# Altium schematic sheet MPBoard_L4_Sens1_ext.SchDoc
size A3; SheetNumber: 4; SheetTotal: 5
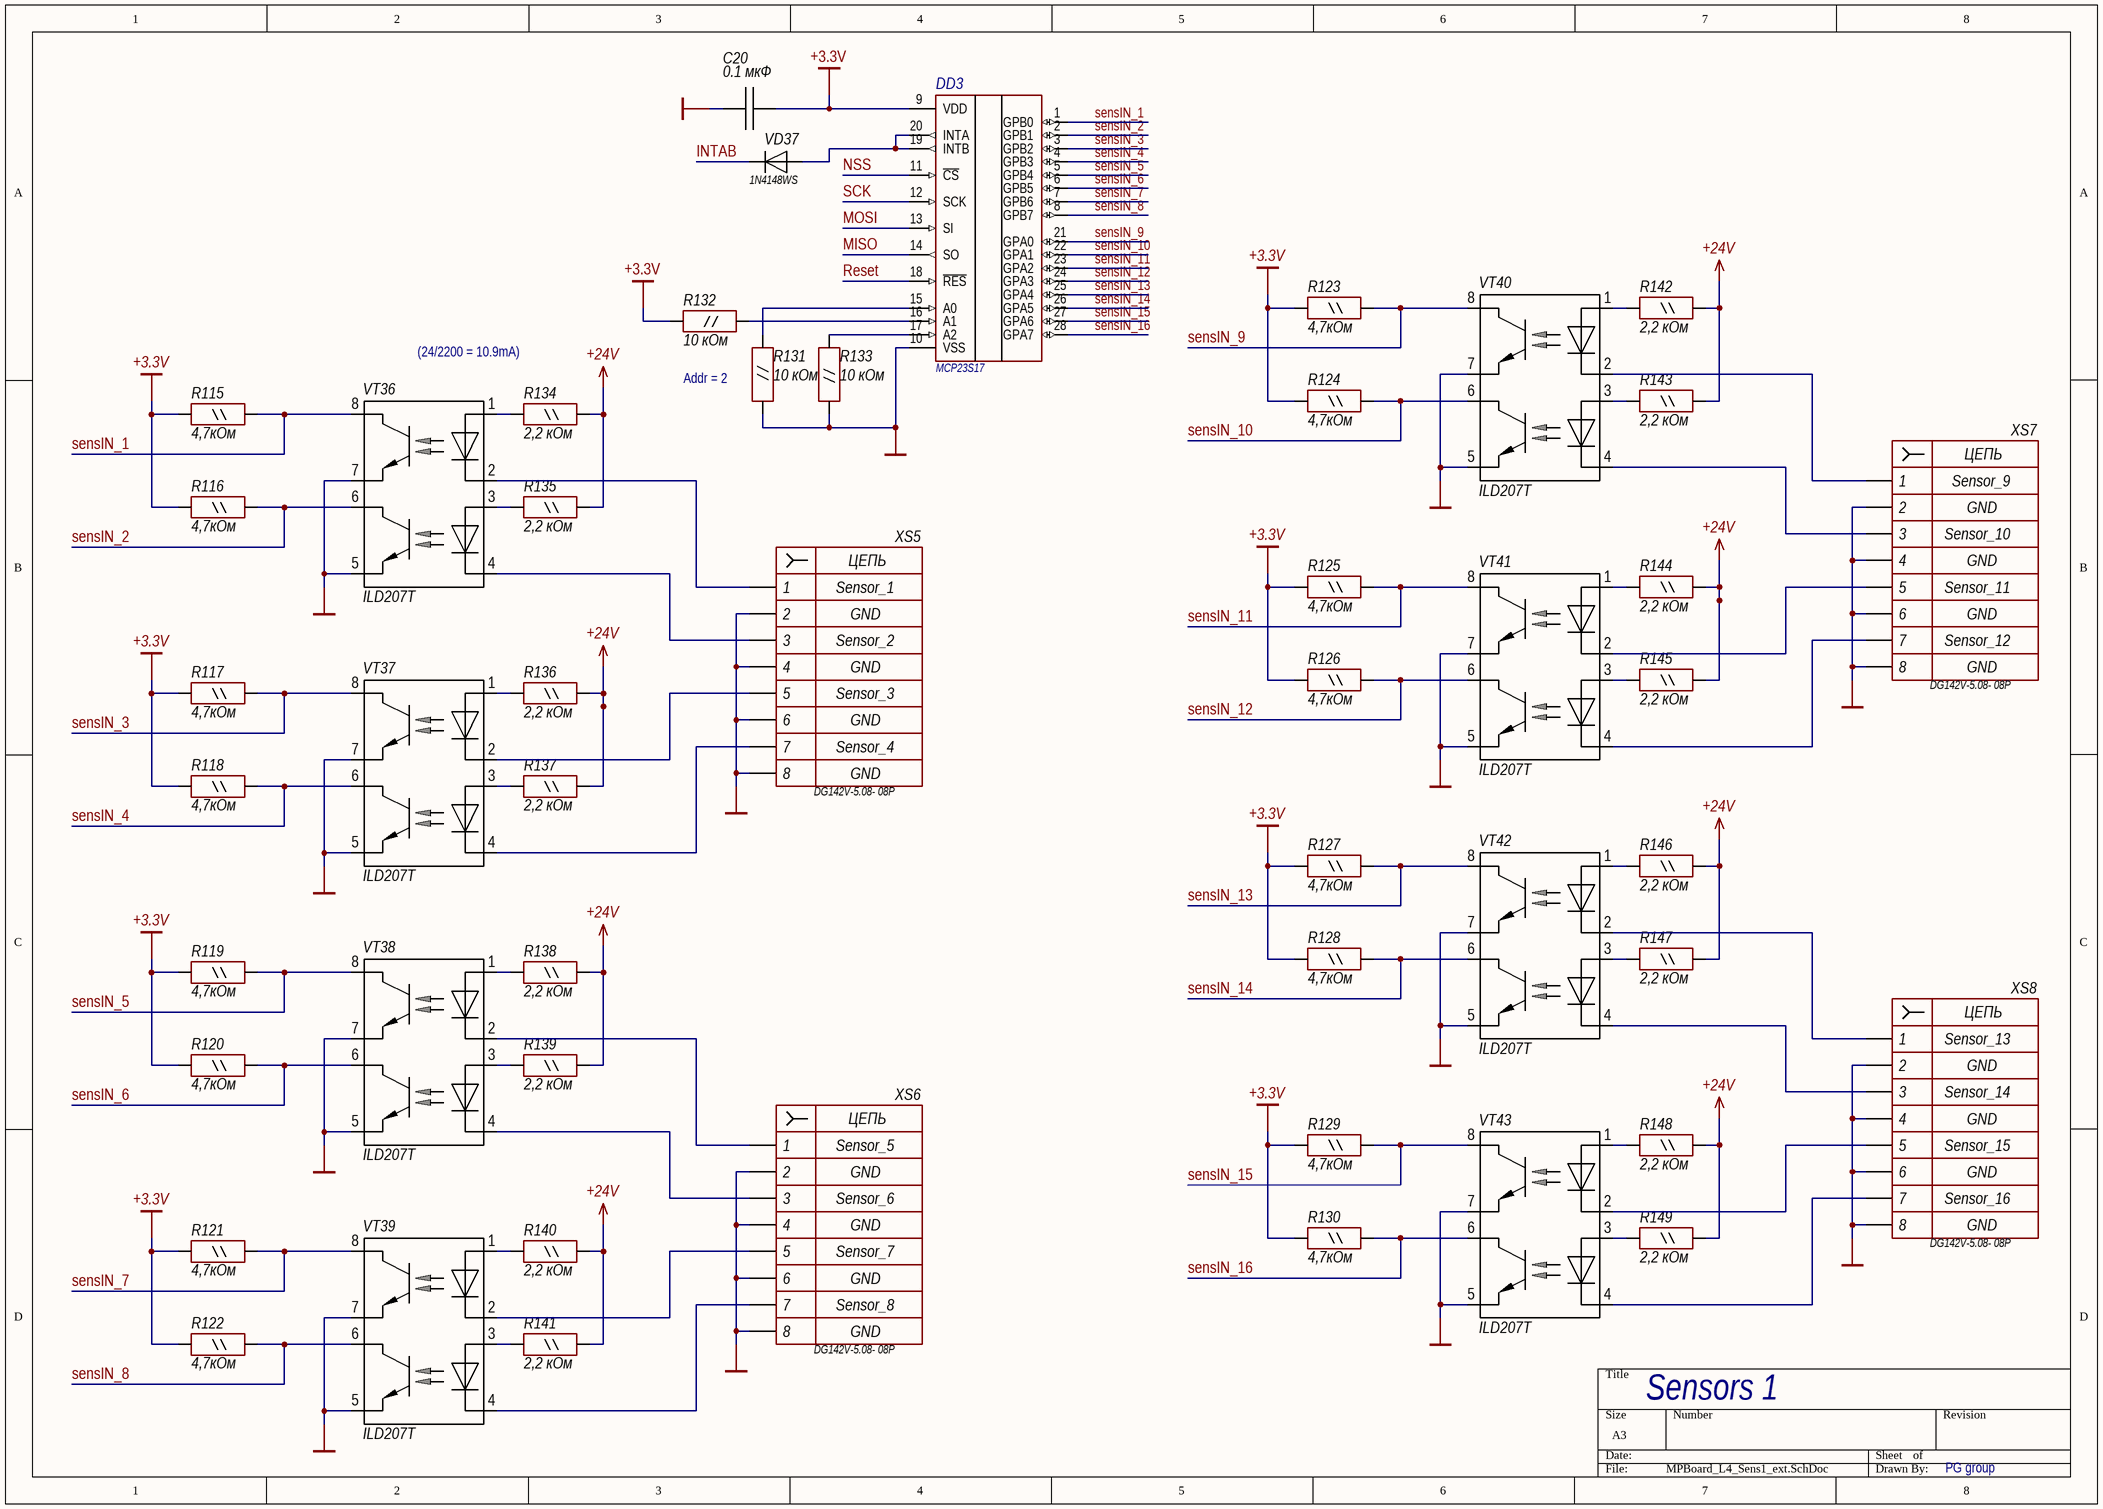
[diagram p0: MPBoard_L4_Sens1_ext.SchDoc]

## Parts
C20  0.1 мкФ  [CAP-0603]
DD3  MCP23S17  [SOIC-28]
R115  4,7кОм  [RES-0603]
R116  4,7кОм  [RES-0603]
R117  4,7кОм  [RES-0603]
R118  4,7кОм  [RES-0603]
R119  4,7кОм  [RES-0603]
R120  4,7кОм  [RES-0603]
R121  4,7кОм  [RES-0603]
R122  4,7кОм  [RES-0603]
R123  4,7кОм  [RES-0603]
R124  4,7кОм  [RES-0603]
R125  4,7кОм  [RES-0603]
R126  4,7кОм  [RES-0603]
R127  4,7кОм  [RES-0603]
R128  4,7кОм  [RES-0603]
R129  4,7кОм  [RES-0603]
R130  4,7кОм  [RES-0603]
R131  10 кОм  [RES-0603]
R132  10 кОм  [RES-0603]
R133  10 кОм  [RES-0603]
R134  2,2 кОм  [RES-0805]
R135  2,2 кОм  [RES-0805]
R136  2,2 кОм  [RES-0805]
R137  2,2 кОм  [RES-0805]
R138  2,2 кОм  [RES-0805]
R139  2,2 кОм  [RES-0805]
R140  2,2 кОм  [RES-0805]
R141  2,2 кОм  [RES-0805]
R142  2,2 кОм  [RES-0805]
R143  2,2 кОм  [RES-0805]
R144  2,2 кОм  [RES-0805]
R145  2,2 кОм  [RES-0805]
R146  2,2 кОм  [RES-0805]
R147  2,2 кОм  [RES-0805]
R148  2,2 кОм  [RES-0805]
R149  2,2 кОм  [RES-0805]
VD37  1N4148WS  [SOD-323]
VT36  ILD207T  [SOIC-8]
VT37  ILD207T  [SOIC-8]
VT38  ILD207T  [SOIC-8]
VT39  ILD207T  [SOIC-8]
VT40  ILD207T  [SOIC-8]
VT41  ILD207T  [SOIC-8]
VT42  ILD207T  [SOIC-8]
VT43  ILD207T  [SOIC-8]
XS5  DG142V-5.08- 08P  NET6: GND  NET5: Sensor_3  NET1: Sensor_1  NET3: Sensor_2  NET7: Sensor_4  [DG142V-5.08-08]
XS6  DG142V-5.08- 08P  NET6: GND  NET5: Sensor_7  NET1: Sensor_5  NET3: Sensor_6  NET7: Sensor_8  [DG142V-5.08-08]
XS7  DG142V-5.08- 08P  NET6: GND  NET5: Sensor_11  NET1: Sensor_9  NET3: Sensor_10  NET7: Sensor_12  [DG142V-5.08-08]
XS8  DG142V-5.08- 08P  NET6: GND  NET5: Sensor_15  NET1: Sensor_13  NET3: Sensor_14  NET7: Sensor_16  [DG142V-5.08-08]

## Nets
+3.3V: C20.2 DD3.9(VDD) R115.2 R116.2 R117.2 R118.2 R119.2 R120.2 R121.2 R122.2 R123.2 R124.2 R125.2 R126.2 R127.2 R128.2 R129.2 R130.2 R132.2
+24V: R134.1 R135.1 R136.1 R137.1 R138.1 R139.1 R140.1 R141.1 R142.1 R143.1 R144.1 R145.1 R146.1 R147.1 R148.1 R149.1
GND: C20.1 DD3.10(VSS) R131.2 R133.1 VT36.5 VT36.7 VT37.5 VT37.7 VT38.5 VT38.7 VT39.5 VT39.7 VT40.5 VT40.7 VT41.5 VT41.7 VT42.5 VT42.7 VT43.5 VT43.7 XS5.2 XS5.4 XS5.6 XS5.8 XS6.2 XS6.4 XS6.6 XS6.8 XS7.2 XS7.4 XS7.6 XS7.8 XS8.2 XS8.4 XS8.6 XS8.8
INTAB: VD37.2
MISO: DD3.14(SO)
MOSI: DD3.13(SI)
NSS: DD3.11(~{CS})
Reset: DD3.18(~{RES})
SCK: DD3.12(SCK)
sensIN_1: DD3.1(GPB0) R115.1 VT36.8
sensIN_2: DD3.2(GPB1) R116.1 VT36.6
sensIN_3: DD3.3(GPB2) R117.1 VT37.8
sensIN_4: DD3.4(GPB3) R118.1 VT37.6
sensIN_5: DD3.5(GPB4) R119.1 VT38.8
sensIN_6: DD3.6(GPB5) R120.1 VT38.6
sensIN_7: DD3.7(GPB6) R121.1 VT39.8
sensIN_8: DD3.8(GPB7) R122.1 VT39.6
sensIN_9: DD3.21(GPA0) R123.1 VT40.8
sensIN_10: DD3.22(GPA1) R124.1 VT40.6
sensIN_11: DD3.23(GPA2) R125.1 VT41.8
sensIN_12: DD3.24(GPA3) R126.1 VT41.6
sensIN_13: DD3.25(GPA4) R127.1 VT42.8
sensIN_14: DD3.26(GPA5) R128.1 VT42.6
sensIN_15: DD3.27(GPA6) R129.1 VT43.8
sensIN_16: DD3.28(GPA7) R130.1 VT43.6
NetDD3_15: DD3.15(A0) R131.1
NetDD3_16: DD3.16(A1) R132.1
NetDD3_17: DD3.17(A2) R133.2
NetDD3_19: DD3.19(INTB) DD3.20(INTA) VD37.1
NetR134_2: R134.2 VT36.1
NetR135_2: R135.2 VT36.3
NetR136_2: R136.2 VT37.1
NetR137_2: R137.2 VT37.3
NetR138_2: R138.2 VT38.1
NetR139_2: R139.2 VT38.3
NetR140_2: R140.2 VT39.1
NetR141_2: R141.2 VT39.3
NetR142_2: R142.2 VT40.1
NetR143_2: R143.2 VT40.3
NetR144_2: R144.2 VT41.1
NetR145_2: R145.2 VT41.3
NetR146_2: R146.2 VT42.1
NetR147_2: R147.2 VT42.3
NetR148_2: R148.2 VT43.1
NetR149_2: R149.2 VT43.3
NetVT36_2: VT36.2 XS5.1
NetVT36_4: VT36.4 XS5.3
NetVT37_2: VT37.2 XS5.5
NetVT37_4: VT37.4 XS5.7
NetVT38_2: VT38.2 XS6.1
NetVT38_4: VT38.4 XS6.3
NetVT39_2: VT39.2 XS6.5
NetVT39_4: VT39.4 XS6.7
NetVT40_2: VT40.2 XS7.1
NetVT40_4: VT40.4 XS7.3
NetVT41_2: VT41.2 XS7.5
NetVT41_4: VT41.4 XS7.7
NetVT42_2: VT42.2 XS8.1
NetVT42_4: VT42.4 XS8.3
NetVT43_2: VT43.2 XS8.5
NetVT43_4: VT43.4 XS8.7

## Notes on the sheet
- (24/2200 = 10.9mA)
- (near R131) Addr = 2
- Sensors 1
- PG group
- (in symbol XS8) ЦЕПЬ

## Library data of the parts
C20 = C: Конденсатор; MFPartNum: C0603C101K5GAC; IPSPartNumber: 65-724-19; Dielectric: X7R; MF: KEMET; Tolerance: ± 10 %; Voltage: 50 В; ValueDescription: Конденсатор 0.1 мкФ ± 10 % 50 В X7R SMD 0603; Package: SMD 0603; Value: 0.1 мкФ; HelpURL: https://content.kemet.com/datasheets/KEM_C1002_X7R_SMD.pdf; NameRUS: Конденсатор
DD3 = DD_MCP23S17: I/O Expander 16 SPI; MF: Microchip; MFPartNum: MCP23S17; Package: SOIC-28; HelpURL: https://www.chipdip.ru/product/mcp23s17-e-so
R115-R130 = R_0.125W: Резистор 0.1 W; MFPartNum: D11/CRCW0603; MF: Vishay; Tolerance: ± 1 %; ValueDescription: Резистор 4,7кОм ± 1 % SMD 0603; Package: SMD 0603; Value: 4,7кОм; HelpURL: https://www.vishay.com/docs/20035/dcrcwe3.pdf; IPSPartNumber: *; NameRUS: Резистор
R131-R133 = R_0.125W: Резистор 0.1 W; MFPartNum: D11/CRCW0603; MF: Vishay; Tolerance: ± 1 %; ValueDescription: Резистор 10 кОм ± 1 % SMD 0603; Package: SMD 0603; Value: 10 кОм; HelpURL: https://www.vishay.com/docs/20035/dcrcwe3.pdf; IPSPartNumber: *; NameRUS: Резистор
R134-R149 = R_0.125W: Резистор 0.125 W; MFPartNum: CRCW080513K3FKEA; MF: Vishay; Tolerance: ± 1 %; ValueDescription: Резистор 2,2 кОм ± 1 % SMD 0805; Package: SMD 0805; Value: 2,2 кОм; HelpURL: https://www.vishay.com/docs/20035/dcrcwe3.pdf; IPSPartNumber: *; NameRUS: Резистор
VD37 = VD: Диод Выпрямительный; MF: Diotec Semiconductor; ValueDescription: Диод выпрямительный 1N4148WS SOD-323F; MFPartNum: 1N4148WS; HelpURL: https://www.chipdip.by/product/1n4148ws-4; Value: 1N4148WS; Package: SOD-323F; NameRUS: Диод выпрямительный
VT36-VT43 = VT_2xOPTOCOUPLER: Оптопара; MF: Vishay; MFPartNum: ILD207T; Package: SOIC-8; HelpURL: https://www.chipdip.by/product/ild207-t
XS5-XS8 = XS8: розетка 8 контактов; MFPartNum: DG142V-5.08- 08P-14-00A(H); MF: Degson Electronics; ValueDescription: Разъем розетка DG142V-5.08- 08P; NameRUS: Разъем розетка; Value: DG142V-5.08- 08P; HelpURL: https://www.chipdip.by/product0/8077186472; IPSPartNumber: *; NET2: GND; NET4: GND; NET8: GND